# Altium project Solenoid-Switching-Board-v1.0.PrjPcb (part 1 of 5)
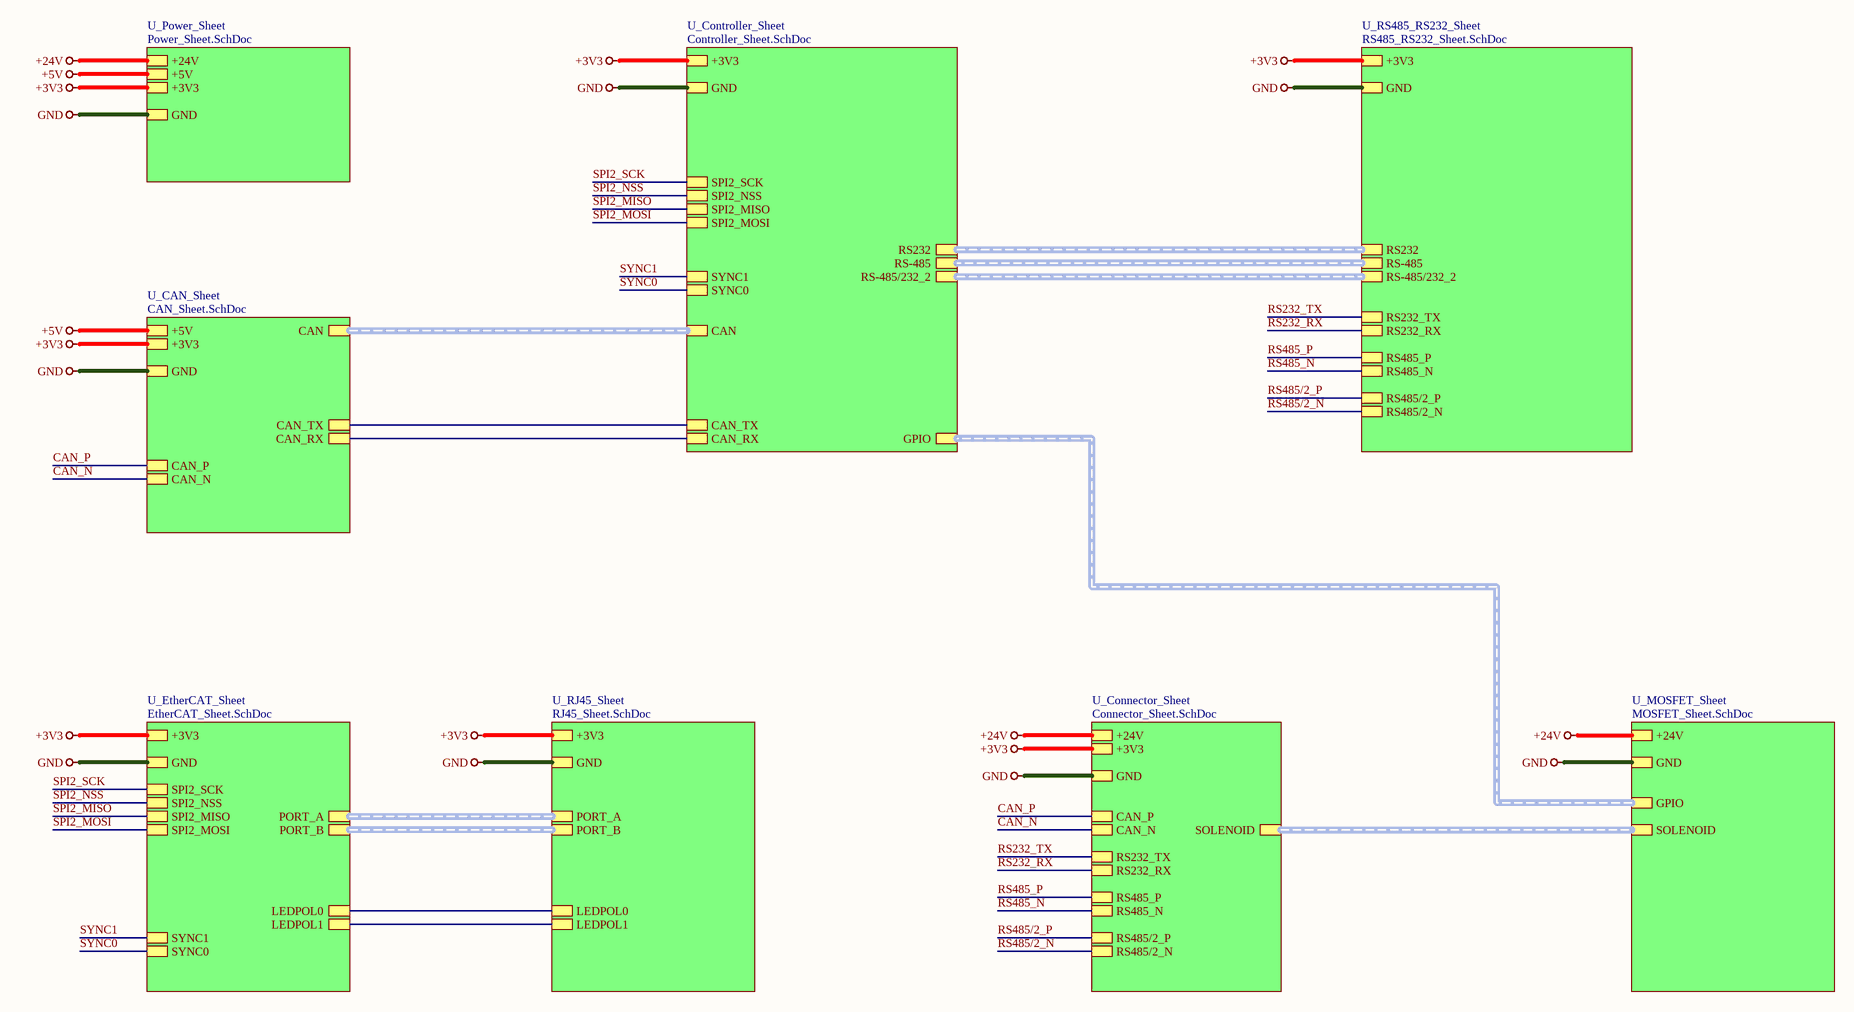
[diagram p0: Top_Sheet.SchDoc]
9 sheets, 288 parts. Net scope: hierarchical (ports join the sheet entries above them; power ports are global).
Board file: PCB_Solenoid_Board-v1.0.PcbDoc
Sheets:
  Top_Sheet.SchDoc
    U_CAN_Sheet = CAN_Sheet.SchDoc
    U_Connector_Sheet = Connector_Sheet.SchDoc
    U_Controller_Sheet = Controller_Sheet.SchDoc
    U_EtherCAT_Sheet = EtherCAT_Sheet.SchDoc
    U_MOSFET_Sheet = MOSFET_Sheet.SchDoc
    U_Power_Sheet = Power_Sheet.SchDoc
    U_RJ45_Sheet = RJ45_Sheet.SchDoc
    U_RS485_RS232_Sheet = RS485_RS232_Sheet.SchDoc

## Sheet Top_Sheet.SchDoc
size 420 x 297 mm; SheetNumber: 1; SheetTotal: 9

### Sub-sheets
U_CAN_Sheet = CAN_Sheet.SchDoc: CAN (harness CAN), CAN_RX, CAN_TX, CAN_P, CAN_N, +5V, +3V3, GND
U_Connector_Sheet = Connector_Sheet.SchDoc: RS485/2_N, RS485/2_P, RS485_N, RS485_P, RS232_RX, RS232_TX, CAN_P, CAN_N, +3V3, GND, +24V, SOLENOID (harness SOLENOID)
U_Controller_Sheet = Controller_Sheet.SchDoc: SPI2_SCK, SPI2_NSS, SPI2_MISO, SPI2_MOSI, RS-485/232_2 (harness RS-485/232_2), RS232 (harness RS232), +3V3, GND, RS-485 (harness RS-485), CAN_RX, CAN_TX, CAN (harness CAN), GPIO (harness GPIO), SYNC1, SYNC0
U_EtherCAT_Sheet = EtherCAT_Sheet.SchDoc: PORT_A (harness PORT_A), PORT_B (harness PORT_B), LEDPOL0, LEDPOL1, SPI2_SCK, SPI2_NSS, SPI2_MISO, SPI2_MOSI, +3V3, GND, SYNC1, SYNC0
U_MOSFET_Sheet = MOSFET_Sheet.SchDoc: SOLENOID (harness SOLENOID), GND, GPIO (harness GPIO), +24V
U_Power_Sheet = Power_Sheet.SchDoc: +24V, +5V, +3V3, GND
U_RJ45_Sheet = RJ45_Sheet.SchDoc: PORT_A (harness PORT_A), PORT_B (harness PORT_B), LEDPOL0, LEDPOL1, +3V3, GND
U_RS485_RS232_Sheet = RS485_RS232_Sheet.SchDoc: RS485_N, RS485_P, RS232_RX, RS232_TX, RS-485 (harness RS-485), +3V3, GND, RS485/2_N, RS485/2_P, RS-485/232_2 (harness RS-485/232_2), RS232 (harness RS232)

### Nets
+3V3: sheet U_CAN_Sheet/+3V3, sheet U_Connector_Sheet/+3V3, sheet U_Controller_Sheet/+3V3, sheet U_EtherCAT_Sheet/+3V3, sheet U_Power_Sheet/+3V3, sheet U_RJ45_Sheet/+3V3, sheet U_RS485_RS232_Sheet/+3V3
+5V: sheet U_CAN_Sheet/+5V, sheet U_Power_Sheet/+5V
+24V: sheet U_Connector_Sheet/+24V, sheet U_MOSFET_Sheet/+24V, sheet U_Power_Sheet/+24V
CAN_RX: sheet U_CAN_Sheet/CAN_RX, sheet U_Controller_Sheet/CAN_RX
CAN_TX: sheet U_CAN_Sheet/CAN_TX, sheet U_Controller_Sheet/CAN_TX
GND: sheet U_CAN_Sheet/GND, sheet U_Connector_Sheet/GND, sheet U_Controller_Sheet/GND, sheet U_EtherCAT_Sheet/GND, sheet U_MOSFET_Sheet/GND, sheet U_Power_Sheet/GND, sheet U_RJ45_Sheet/GND, sheet U_RS485_RS232_Sheet/GND
RS232_RX: sheet U_Connector_Sheet/RS232_RX, sheet U_RS485_RS232_Sheet/RS232_RX
RS232_TX: sheet U_Connector_Sheet/RS232_TX, sheet U_RS485_RS232_Sheet/RS232_TX
CAN_N: sheet U_CAN_Sheet/CAN_N, sheet U_Connector_Sheet/CAN_N
CAN_P: sheet U_CAN_Sheet/CAN_P, sheet U_Connector_Sheet/CAN_P
LEDPOL0: sheet U_EtherCAT_Sheet/LEDPOL0, sheet U_RJ45_Sheet/LEDPOL0
LEDPOL1: sheet U_EtherCAT_Sheet/LEDPOL1, sheet U_RJ45_Sheet/LEDPOL1
RS485/2_N: sheet U_Connector_Sheet/RS485/2_N, sheet U_RS485_RS232_Sheet/RS485/2_N
RS485/2_P: sheet U_Connector_Sheet/RS485/2_P, sheet U_RS485_RS232_Sheet/RS485/2_P
RS485_N: sheet U_Connector_Sheet/RS485_N, sheet U_RS485_RS232_Sheet/RS485_N
RS485_P: sheet U_Connector_Sheet/RS485_P, sheet U_RS485_RS232_Sheet/RS485_P
SPI2_MISO: sheet U_Controller_Sheet/SPI2_MISO, sheet U_EtherCAT_Sheet/SPI2_MISO
SPI2_MOSI: sheet U_Controller_Sheet/SPI2_MOSI, sheet U_EtherCAT_Sheet/SPI2_MOSI
SPI2_NSS: sheet U_Controller_Sheet/SPI2_NSS, sheet U_EtherCAT_Sheet/SPI2_NSS
SPI2_SCK: sheet U_Controller_Sheet/SPI2_SCK, sheet U_EtherCAT_Sheet/SPI2_SCK
SYNC0: sheet U_Controller_Sheet/SYNC0, sheet U_EtherCAT_Sheet/SYNC0
SYNC1: sheet U_Controller_Sheet/SYNC1, sheet U_EtherCAT_Sheet/SYNC1

### Buses and harness runs
harness sheet U_CAN_Sheet/CAN = sheet U_Controller_Sheet/CAN
harness sheet U_Connector_Sheet/SOLENOID = sheet U_MOSFET_Sheet/SOLENOID
harness sheet U_Controller_Sheet/GPIO = sheet U_MOSFET_Sheet/GPIO
harness sheet U_Controller_Sheet/RS232 = sheet U_RS485_RS232_Sheet/RS232
harness sheet U_Controller_Sheet/RS-485 = sheet U_RS485_RS232_Sheet/RS-485
harness sheet U_Controller_Sheet/RS-485/232_2 = sheet U_RS485_RS232_Sheet/RS-485/232_2
harness sheet U_EtherCAT_Sheet/PORT_A = sheet U_RJ45_Sheet/PORT_A
harness sheet U_EtherCAT_Sheet/PORT_B = sheet U_RJ45_Sheet/PORT_B

### Notes on the sheet
- File:
- Title:
- Date:
- Page
- Num:
- Total:
- Drawn By: Huzaifa Ali

## Sheet CAN_Sheet.SchDoc
size 420 x 297 mm; SheetNumber: 4; SheetTotal: 9
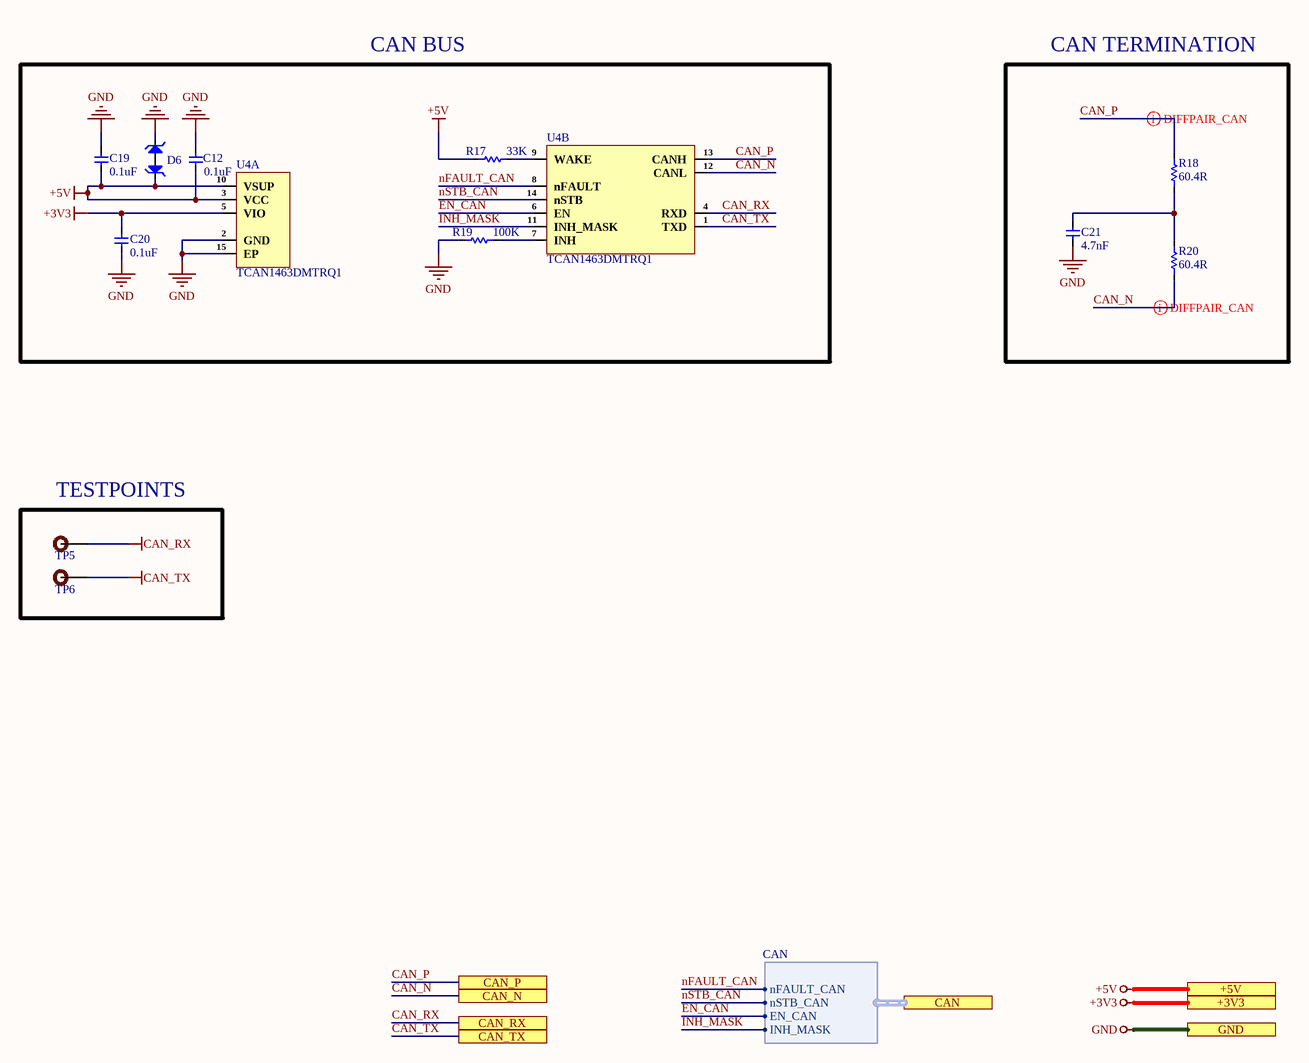
[diagram p1: CAN_Sheet.SchDoc]

### Parts
C12  0.1uF  [Cap-0402]
C19  0.1uF  [Cap-0402]
C20  0.1uF  [Cap-0402]
C21  4.7nF  [Cap-0402]
D6  PESD5V0H1BSFYL  [DSN0603-2]  (value not drawn)
R17  33K  [Res-0402]
R18  60.4R  [Res-0603]
R19  100K  [Res-0402]
R20  60.4R  [Res-0603]
TP5  TEST POINT  [Test-point]  (value not drawn)  (no BOM)
TP6  TEST POINT  [Test-point]  (value not drawn)  (no BOM)
U4  TCAN1463DMTRQ1  [VSON-14(3x4.5)]  (parts A,B of 2)

### Ports
+3V3 (see Top_Sheet[1B], Connector_Sheet[5D], Controller_Sheet[5D], EtherCAT_Sheet[5D], Power_Sheet[5D], RJ45_Sheet[5D], RS485_RS232_Sheet[5D]), +5V (see Top_Sheet[1B], Power_Sheet[5D]), CAN (harness CAN, see Top_Sheet[2B], Controller_Sheet[3D]), CAN_N (see Top_Sheet[1B], Connector_Sheet[3D]), CAN_P (see Top_Sheet[1B], Connector_Sheet[3D]), CAN_RX (see Top_Sheet[2B], Controller_Sheet[2D]), CAN_TX (see Top_Sheet[2B], Controller_Sheet[2D]), GND (see Top_Sheet[1B], Connector_Sheet[5D], Controller_Sheet[5D], EtherCAT_Sheet[5D], MOSFET_Sheet[5D], Power_Sheet[5D], RJ45_Sheet[5D], RS485_RS232_Sheet[5D])

### Harnesses
CAN: nFAULT_CAN, nSTB_CAN, EN_CAN, INH_MASK

### Nets
+3V3: C20.2 U4.5(VIO) ; port +3V3
+5V: C12.1 C19.1 D6.1 R17.1 U4.3(VCC) U4.10(VSUP) ; port +5V
CAN_RX: TP5.1 U4.4(RXD) ; port CAN_RX
CAN_TX: TP6.1 U4.1(TXD) ; port CAN_TX
GND: C12.2 C19.2 C20.1 C21.2 D6.2 R19.1 U4.2(GND) U4.15(EP) ; port GND
CAN_N: R20.2 U4.12(CANL) ; port CAN_N
CAN_P: R18.1 U4.13(CANH) ; port CAN_P
EN_CAN: U4.6(EN) ; port CAN.EN_CAN
INH_MASK: U4.11(INH_MASK) ; port CAN.INH_MASK
nFAULT_CAN: U4.8(nFAULT) ; port CAN.nFAULT_CAN
nSTB_CAN: U4.14(nSTB) ; port CAN.nSTB_CAN
NetC21_1: C21.1 R18.2 R20.1
NetR17_2: R17.2 U4.9(WAKE)
NetR19_2: R19.2 U4.7(INH)

### Layout directives
differential pair; net class CAN; differential pair class CAN_Lines: CAN_N, CAN_P

### Notes on the sheet
- CAN BUS
- CAN TERMINATION
- (near TP5) TESTPOINTS
- File:
- Title:
- Date:
- Page
- Num:
- Total:
- Drawn By: Huzaifa Ali

### Library data of the parts
C12 C19 C20 = CC0402JRX7R7BB104: CAP CER 0.1UF 16V X7R 0402; Manufacturer: Yageo; Material: 4241ConductorMaterial; Value: 100nF; Tolerance: 5%; Item Type: Capacitor; Supplier: Digikey; Supplier Part Number: 311-1676-1-ND; Manufacturer Part Number: CC0402JRX7R7BB104; RoHS: Yes; Category: Ceramic Capacitors; Stock: 1659111; Pricing: 1=0.1, 10=0.046, 50=0.0262, 100=0.0203, 500=0.01528, 1000=0.012, 2500=0.01091, 5000=0.01004 (USD); Mounting Technology: Surface Mount; Case/Package: 0402; Case Code (Metric): 1005; Case Code (Imperial): 0402; Min Operating Temperature: -55°C; Max Operating Temperature: 125°C; Dielectric: X7R; Packaging: Tape and Reel; Package Quantity: 10000; Voltage Rating (DC): 16V; Voltage Rating: 16V; Series: CC; Construction: Flat; Length: 0.039inch; Width: 0.02inch; Height: 0.5mm; Thickness: 0.022inch; Lead Free: Lead Free; Halogen Free: Halogen Free; RoHS Compliant: Yes; ComponentLink1URL: https://datasheet.ciiva.com/13210/upy-gphc-x7r-6-3v-to-50v-8-12304-13210152.pdf?src-supplier=Mouser; ComponentLink1Description: https://datasheet.ciiva.com/13210/upy-gphc-x7r-6-3v-to-50v-8-12304-13210152.pdf?src-supplier=Mouser; LCSC Part Number: C541464
C21 = CC0402KRX7R9BB472: CAP CER 4700PF 50V X7R 0402; Manufacturer: Yageo; Material: 4241ConductorMaterial; Tolerance: 10%; Temperature Coefficient: 30ppm/°C; Item Type: Capacitor; Supplier 1: Future Electronics; Manufacturer Part Number: CC0402KRX7R9BB472; RoHS: Yes; Category: Ceramic Capacitors; Stock 1: 1780000; Pricing 1: 10000=0.0021, 40000=0.002, 150000=0.0019, 400000=0.0018, 1000000=0.0017 (USD); Mount: Surface Mount; Case/Package: 0402; Number of Pins: 2NUMBER; Case Code (Imperial): 0402; Case Code (Metric): 1005; Min Operating Temperature: -55°C; Max Operating Temperature: 125°C; Capacitance: 4.7nF; Dielectric: X7R; Voltage Rating: 50V; Voltage Rating (DC): 50V; Packaging: Tape and Reel; Package Quantity: 1; Termination: SMD/SMT; Series: CC; Construction: Flat; Length: 1mm; Width: 0.02inch; Height: 0.5mm; Thickness: 0.022inch; Depth: 0.5mm; Radiation Hardening: No; Reach SVHC Compliant: No; RoHS Compliant: Yes; Halogen Free: 5694HalogenFree; Lead Free: 5697LeadFree; ComponentLink1URL: https://datasheet.ciiva.com/7978/1489800-7978108.pdf?src-supplier=Element14; ComponentLink1Description: https://datasheet.ciiva.com/7978/1489800-7978108.pdf?src-supplier=Element14; ComponentLink2URL: https://datasheet.ciiva.com/176/mlccorderingcode-176364.pdf?src-supplier=Digikey; ComponentLink2Description: https://datasheet.ciiva.com/176/mlccorderingcode-176364.pdf?src-supplier=Digikey; ComponentLink3URL: https://datasheet.ciiva.com/176/mlccorderingcode-176363.pdf?src-supplier=Digikey; ComponentLink3Description: https://datasheet.ciiva.com/176/mlccorderingcode-176363.pdf?src-supplier=Digikey; ComponentLink4URL: https://datasheet.ciiva.com/176/mlccorderingcode-176365.pdf?src-supplier=Digikey; ComponentLink4Description: https://datasheet.ciiva.com/176/mlccorderingcode-176365.pdf?src-supplier=Digikey; ComponentLink5URL: https://datasheet.ciiva.com/11586/upy-gphc-x7r-6-3v-to-50v-8-11586491.pdf?src-supplier=Avnet; ComponentLink5Description: https://datasheet.ciiva.com/11586/upy-gphc-x7r-6-3v-to-50v-8-11586491.pdf?src-supplier=Avnet; Supplier Part Number 1: 1989300
D6 = PESD5V0H1BSFYL: TVS DIODE 5VWM 6.3VC DSN0603-2; Manufacturer: Nexperia; Supplier 1: Avnet; Manufacturer Part Number: PESD5V0H1BSFYL; RoHS: Yes; Category: ESD and Circuit Protection ICs; Stock 1: 9000; Pricing 1: 18000=0.06453, 36000=0.06278, 54000=0.06104, 90000=0.05930, 180000=0.05755, 900000=0.05581, 1800000=0.05406 (USD); RoHS Compliant: Yes; ComponentLink1URL: http://www.farnell.com/datasheets/1961312.pdf?src-supplier=Farnell; ComponentLink1Description: http://www.farnell.com/datasheets/1961312.pdf?src-supplier=Farnell; ComponentLink2URL: https://assets.nexperia.com/documents/data-sheet/PESD5V0H1BSF.pdf?src-supplier=Digi-Key; ComponentLink2Description: https://assets.nexperia.com/documents/data-sheet/PESD5V0H1BSF.pdf?src-supplier=Digi-Key; ComponentLink3URL: http://www.farnell.com/datasheets/1961312.pdf?src-supplier=Newark; ComponentLink3Description: http://www.farnell.com/datasheets/1961312.pdf?src-supplier=Newark; Supplier Part Number 1: PESD5V0H1BSFYL; LCSC Part Number: C477989; Item Type: Diode
R17 = RC0402FR-0733KL: RES 33K OHM 1% 1/16W 0402; Manufacturer: YAGEO; Item Type: Resistor; Manufacturer Part Number: RC0402FR-0733KL; Package: 0402; LCSC Part Number: C138003; ComponentLink1Description: LCSC; ComponentLink1URL: https://www.lcsc.com/product-detail/Chip-Resistor-Surface-Mount_YAGEO-RC0402FR-0733KL_C138003.html
R18 R20 = RTT0360R4FTP: 100mW Thick Film Resistors ±100ppm/℃ ±1% 60.4Ω 0603 Chip Resistor - Surface Mount ROHS; Manuacturer: RALEC; Manufacturer Part Number: RTT0360R4FTP; Package: 0603; Value: 60.4R; LCSC Part Number: C103744; ComponentLink1Description: LCSC; ComponentLink1URL: https://www.lcsc.com/product-detail/Chip-Resistor-Surface-Mount_RALEC-RTT0360R4FTP_C103744.html
R19 = RC0402FR-07100KL: RES 100K OHM 1% 1/16W 0402; Manufacturer: Yageo; Resistance: 100kR; Temperature Coefficient: 100ppm/°C; Power Rating: 63mW; Voltage Rating: 50V; Item Type: Resistor; Supplier 1: Mouser; Manufacturer Part Number: RC0402FR-07100KL; RoHS: Yes; Category: Chip SMD Resistors; Stock 1: 7759549; Pricing 1: 1=0.10000, 10=0.01200, 50=0.01200, 100=0.00500, 1000=0.00300, 2500=0.00200, 10000=0.00100 (USD); Case/Package: 0402; Case Code (Metric): 1005; Case Code (Imperial): 0402; Min Operating Temperature: -55°C; Max Operating Temperature: 155°C; Resistor Type: Thick Film; Tolerance: 1%; Packaging: Tape and Reel; Package Quantity: 1; Number of Terminations: 2; Termination: SMD/SMT; Max Power Dissipation: 63mW; Working Voltage: 50V; Features: Moisture Resistant; Series: RC; Resistance Tolerance: 1%; Construction: Rectangular; Technology: THICK FILM; Length: 0.039inch; Width: 0.02inch; Height: 0.016inch; Depth: 0.5mm; REACH SVHC: No SVHC; Lead Free: Lead Free; RoHS Compliant: Yes; Military Standard: Not; ComponentLink1URL: https://datasheet.ciiva.com/11819/0900766b80c66297-11819452.pdf?src-supplier=RSComponents; ComponentLink1Description: https://datasheet.ciiva.com/11819/0900766b80c66297-11819452.pdf?src-supplier=RSComponents; ComponentLink2URL: https://datasheet.ciiva.com/22747/1018594-22747509.pdf?src-supplier=Element14; ComponentLink2Description: https://datasheet.ciiva.com/22747/1018594-22747509.pdf?src-supplier=Element14; ComponentLink3URL: https://datasheet.ciiva.com/2453/pyu-r-int-thick-7-2453362.pdf?src-supplier=Digi-Key; ComponentLink3Description: https://datasheet.ciiva.com/2453/pyu-r-int-thick-7-2453362.pdf?src-supplier=Digi-Key; ComponentLink4URL: https://datasheet.ciiva.com/2453/pyu-r-int-thick-7-2453363.pdf?src-supplier=Digi-Key; ComponentLink4Description: https://datasheet.ciiva.com/2453/pyu-r-int-thick-7-2453363.pdf?src-supplier=Digi-Key; ComponentLink5URL: https://datasheet.ciiva.com/2453/pyu-r-int-thick-7-2453361.pdf?src-supplier=Digi-Key; ComponentLink5Description: https://datasheet.ciiva.com/2453/pyu-r-int-thick-7-2453361.pdf?src-supplier=Digi-Key; ComponentLink6URL: https://datasheet.ciiva.com/12667/pyu-rc0402-51-rohs-l-6-r-12667930.pdf?src-supplier=Mouser; ComponentLink6Description: https://datasheet.ciiva.com/12667/pyu-rc0402-51-rohs-l-6-r-12667930.pdf?src-supplier=Mouser; ComponentLink7URL: https://datasheet.ciiva.com/15189/getdatasheetpartid-323696-15189334.pdf?src-supplier=Verical; ComponentLink7Description: https://datasheet.ciiva.com/15189/getdatasheetpartid-323696-15189334.pdf?src-supplier=Verical; Supplier Part Number 1: 603-RC0402FR-07100KL; LCSC Part Number: C60491
TP5 TP6 = TEST POINT: Test Point ON; Item Type: TEST POINT
U4 = TCAN1463DMTRQ1: IC TRANSCEIVER HALF 1/1 14VSON; Manufacturer: Texas Instruments; Supplier: Mouser; Supplier Part Number: 595-TCAN1463DMTRQ1; Manufacturer Part Number: TCAN1463DMTRQ1; RoHS: Yes; Item Type: IC; Stock: 20610; Pricing: 1=2.47, 10=2.22, 50=2.22, 100=1.78, 1000=1.21, 10000=1.09 (USD); LCSC Part Number: C5215823

## Sheet Connector_Sheet.SchDoc
size 420 x 297 mm; SheetNumber: 9; SheetTotal: 9
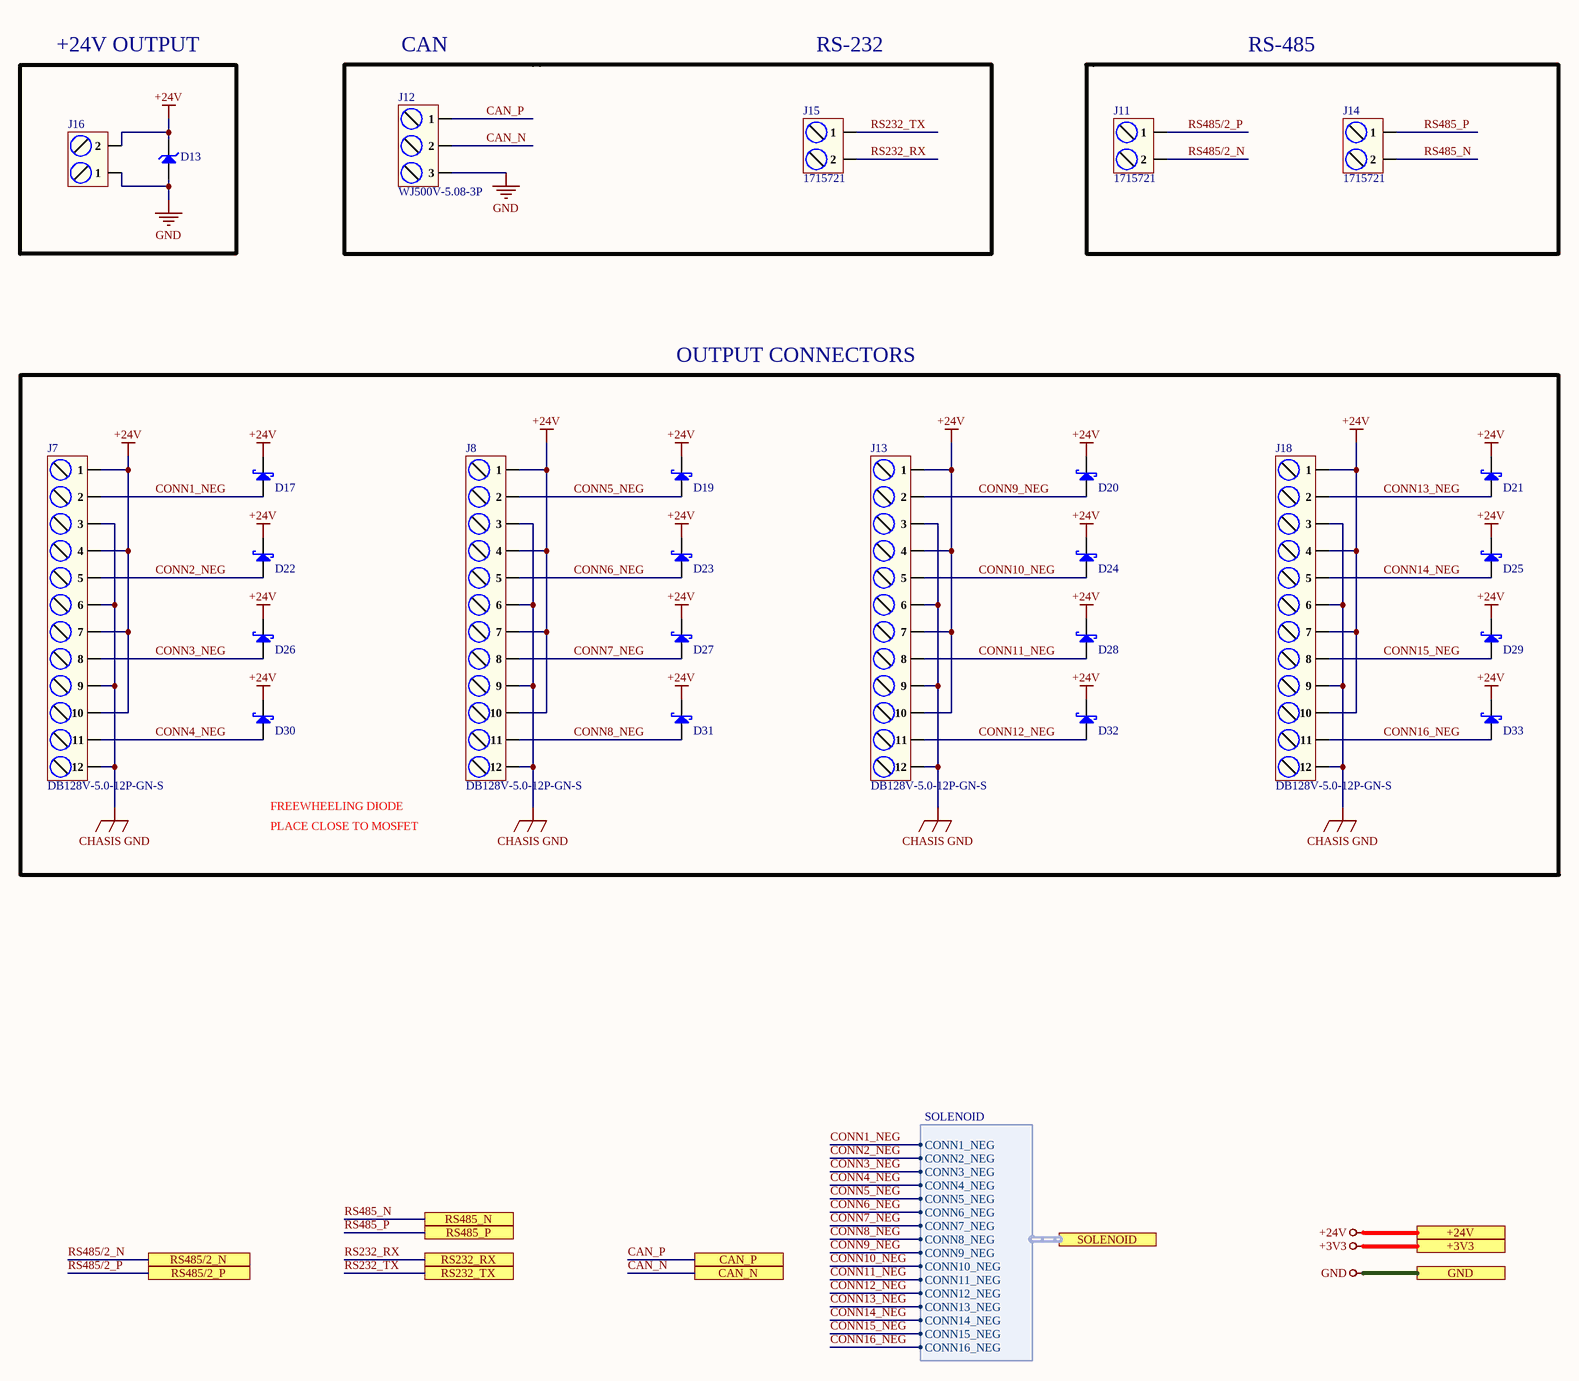
[diagram p2: Connector_Sheet.SchDoc]

### Parts
D13  SMBJ28A-13-F  [SMB_]  (value not drawn)
D17  B150-13-F  [SMA]  (value not drawn)
D19  B150-13-F  [SMA]  (value not drawn)
D20  B150-13-F  [SMA]  (value not drawn)
D21  B150-13-F  [SMA]  (value not drawn)
D22  B150-13-F  [SMA]  (value not drawn)
D23  B150-13-F  [SMA]  (value not drawn)
D24  B150-13-F  [SMA]  (value not drawn)
D25  B150-13-F  [SMA]  (value not drawn)
D26  B150-13-F  [SMA]  (value not drawn)
D27  B150-13-F  [SMA]  (value not drawn)
D28  B150-13-F  [SMA]  (value not drawn)
D29  B150-13-F  [SMA]  (value not drawn)
D30  B150-13-F  [SMA]  (value not drawn)
D31  B150-13-F  [SMA]  (value not drawn)
D32  B150-13-F  [SMA]  (value not drawn)
D33  B150-13-F  [SMA]  (value not drawn)
J7  DB128V-5.0-12P-GN-S  [DB128V-5.0-12P-GN-S]
J8  DB128V-5.0-12P-GN-S  [DB128V-5.0-12P-GN-S]
J11  1715721  [1715721]
J12  WJ500V-5.08-3P  [WJ500V-5.08-3P]
J13  DB128V-5.0-12P-GN-S  [DB128V-5.0-12P-GN-S]
J14  1715721  [1715721]
J15  1715721  [1715721]
J16  MXHB9500-9.5-02P-BK01-Cu-S-A  [MXHB9500-9.5-02P-BK01-Cu-S-A]  (value not drawn)
J18  DB128V-5.0-12P-GN-S  [DB128V-5.0-12P-GN-S]

### Ports
+3V3 (see Top_Sheet[4C], CAN_Sheet[5D], Controller_Sheet[5D], EtherCAT_Sheet[5D], Power_Sheet[5D], RJ45_Sheet[5D], RS485_RS232_Sheet[5D]), +24V (see Top_Sheet[4C], MOSFET_Sheet[5D], Power_Sheet[5D]), CAN_N (see Top_Sheet[4C], CAN_Sheet[3D]), CAN_P (see Top_Sheet[4C], CAN_Sheet[3D]), GND (see Top_Sheet[4C], CAN_Sheet[5D], Controller_Sheet[5D], EtherCAT_Sheet[5D], MOSFET_Sheet[5D], Power_Sheet[5D], RJ45_Sheet[5D], RS485_RS232_Sheet[5D]), RS232_RX (see Top_Sheet[4C], RS485_RS232_Sheet[2D]), RS232_TX (see Top_Sheet[4C], RS485_RS232_Sheet[2D]), RS485/2_N (see Top_Sheet[4C], RS485_RS232_Sheet[1D]), RS485/2_P (see Top_Sheet[4C], RS485_RS232_Sheet[1D]), RS485_N (see Top_Sheet[4C], RS485_RS232_Sheet[2D]), RS485_P (see Top_Sheet[4C], RS485_RS232_Sheet[2D]), SOLENOID (harness SOLENOID, see Top_Sheet[4C], MOSFET_Sheet[2D])

### Harnesses
SOLENOID: CONN1_NEG, CONN2_NEG, CONN3_NEG, CONN4_NEG, CONN5_NEG, CONN6_NEG, CONN7_NEG, CONN8_NEG, CONN9_NEG, CONN10_NEG, CONN11_NEG, CONN12_NEG, CONN13_NEG, CONN14_NEG, CONN15_NEG, CONN16_NEG

### Nets
+24V: D13.2(K) D17.1(K) D19.1(K) D20.1(K) D21.1(K) D22.1(K) D23.1(K) D24.1(K) D25.1(K) D26.1(K) D27.1(K) D28.1(K) D29.1(K) D30.1(K) D31.1(K) D32.1(K) D33.1(K) J7.1 J7.4 J7.7 J7.10 J8.1 J8.4 J8.7 J8.10 J13.1 J13.4 J13.7 J13.10 J16.2 J18.1 J18.4 J18.7 J18.10 ; port +24V
CHASIS GND: J7.3 J7.6 J7.9 J7.12 J8.3 J8.6 J8.9 J8.12 J13.3 J13.6 J13.9 J13.12 J18.3 J18.6 J18.9 J18.12
GND: D13.1(A) J12.3 J16.1 ; port GND
RS232_RX: J15.2 ; port RS232_RX
RS232_TX: J15.1 ; port RS232_TX
CAN_N: J12.2 ; port CAN_N
CAN_P: J12.1 ; port CAN_P
CONN1_NEG: D17.2(A) J7.2 ; port SOLENOID.CONN1_NEG
CONN2_NEG: D22.2(A) J7.5 ; port SOLENOID.CONN2_NEG
CONN3_NEG: D26.2(A) J7.8 ; port SOLENOID.CONN3_NEG
CONN4_NEG: D30.2(A) J7.11 ; port SOLENOID.CONN4_NEG
CONN5_NEG: D19.2(A) J8.2 ; port SOLENOID.CONN5_NEG
CONN6_NEG: D23.2(A) J8.5 ; port SOLENOID.CONN6_NEG
CONN7_NEG: D27.2(A) J8.8 ; port SOLENOID.CONN7_NEG
CONN8_NEG: D31.2(A) J8.11 ; port SOLENOID.CONN8_NEG
CONN9_NEG: D20.2(A) J13.2 ; port SOLENOID.CONN9_NEG
CONN10_NEG: D24.2(A) J13.5 ; port SOLENOID.CONN10_NEG
CONN11_NEG: D28.2(A) J13.8 ; port SOLENOID.CONN11_NEG
CONN12_NEG: D32.2(A) J13.11 ; port SOLENOID.CONN12_NEG
CONN13_NEG: D21.2(A) J18.2 ; port SOLENOID.CONN13_NEG
CONN14_NEG: D25.2(A) J18.5 ; port SOLENOID.CONN14_NEG
CONN15_NEG: D29.2(A) J18.8 ; port SOLENOID.CONN15_NEG
CONN16_NEG: D33.2(A) J18.11 ; port SOLENOID.CONN16_NEG
RS485/2_N: J11.2 ; port RS485/2_N
RS485/2_P: J11.1 ; port RS485/2_P
RS485_N: J14.2 ; port RS485_N
RS485_P: J14.1 ; port RS485_P

### Notes on the sheet
- +24V OUTPUT
- CAN
- RS-232
- RS-485
- OUTPUT CONNECTORS
- FREEWHEELING DIODE
- PLACE CLOSE TO MOSFET
- File:
- Title:
- Date:
- Page
- Num:
- Total:
- Drawn By: Huzaifa Ali

### Library data of the parts
D13 = SMBJ28A-13-F: TVS DIODE 28VWM 45.4VC SMB; Manufacturer: Diodes; Test Current: 1mA; Number of Elements: 1; Power Dissipation: 600W; Forward Voltage: 5V; Direction: Unidirectional; Reverse Breakdown Voltage: 31.1V; Max Surge Current: 13.2A; Reverse Standoff Voltage: 28V; Clamping Voltage: 45.4V; Power Line Protection: No; Breakdown Voltage: 35.8V; Max Reverse Leakage Current: 5uA; Value: 330pF; Diode Type: ZENER; Supplier: Future Electronics; Supplier Part Number: 8797342; Manufacturer Part Number: SMBJ28A-13-F; RoHS: Yes; Category: TVS Diodes; Stock: 39000; Pricing: 3000=0.0734, 9000=0.0706, 15000=0.0693, 30000=0.0676, 60000=0.065 (USD); Mounting Technology: Surface Mount; Case/Package: SMB; Pins: 2; Min Operating Temperature: -55°C; Max Operating Temperature: 150°C; Packaging: Tape and Reel; Package Quantity: 3000; Max Power Dissipation: 600W; Series: SMBJ; Number of Unidirectional Channels: 1; Min Breakdown Voltage: 31.1V; Peak Pulse Power: 600W; Polarity: Unidirectional; Termination: SMD/SMT; Peak Pulse Current: 13.2A; Max Breakdown Voltage: 35.8V; Leakage Current: 5uA; Working Voltage: 28V; Voltage Rating (DC): 28V; Max Output current: 13.2A; Clamping Voltage-Max: 45.4V; Length: 4.57mm; Width: 3.9mm; Height: 2.62mm; Radiation Hardening: No; RoHS Compliant: Yes; Lead Free: Lead Free; ComponentLink1URL: https://datasheet.ciiva.com/16387/ds19002-16387564.pdf?src-supplier=Future+Electronics; ComponentLink1Description: https://datasheet.ciiva.com/16387/ds19002-16387564.pdf?src-supplier=Future+Electronics; ComponentLink2URL: https://datasheet.ciiva.com/26912/getdatasheetpartid-234000-26912533.pdf?src-supplier=Verical; ComponentLink2Description: https://datasheet.ciiva.com/26912/getdatasheetpartid-234000-26912533.pdf?src-supplier=Verical; Item Type: Diode
D17 D19-D33 = B150-13-F: DIODE SCHOTTKY 50V 1A SMA; Manufacturer: Diodes Incorporated; Manufacturer Part Number: B150-13-F; Package: SMA(DO-214AC); LCSC Part Number: C134431; Item Type: Diode
J7 J8 J13 J18 = DB128V-5.0-12P-GN-S: 1x12P 20A -40℃~+105℃ 300V Green 12~30 Direct Insert 5mm 2.5 1 12 Plugin,P=5mm Screw Terminal Blocks ROHS; Manufacturer: DORABO; Manufacturer Part Number: DB128V-5.0-12P-GN-S; Package: Plugin,P=5mm; LCSC Part Number: C424688; Item Type: Terminal Block; ComponentLink1Description: LCSC; ComponentLink1URL: https://www.lcsc.com/product-detail/Screw-Terminal-Blocks_DORABO-DB128V-5-0-12P-GN-S_C424688.html
J11 J14 J15 = 1715721: TERM BLK 2P SIDE ENT 5.08MM PCB; Manufacturer: Phoenix Contact; Item Type: Terminal Blocks; Supplier: Digikey; Supplier Part Number: 277-1263-ND; Manufacturer Part Number: 1715721; RoHS: Yes; Stock: 13160; Pricing: 1=0.94 (USD); ComponentLink1URL: https://datasheet.ciiva.com/1120/1697161-1120393.pdf?src-supplier=Farnell; ComponentLink1Description: https://datasheet.ciiva.com/1120/1697161-1120393.pdf?src-supplier=Farnell; ComponentLink2URL: https://datasheet.ciiva.com/832/1715721-832095.pdf?src-supplier=Digikey; ComponentLink2Description: https://datasheet.ciiva.com/832/1715721-832095.pdf?src-supplier=Digikey; ComponentLink3URL: https://datasheet.ciiva.com/15169/getdatasheetpartid-212174-15169929.pdf?src-supplier=Verical; ComponentLink3Description: https://datasheet.ciiva.com/15169/getdatasheetpartid-212174-15169929.pdf?src-supplier=Verical; ComponentLink4URL: https://datasheet.ciiva.com/16046/1715721-16046034.pdf?src-supplier=Onlinecomponents.com; ComponentLink4Description: https://datasheet.ciiva.com/16046/1715721-16046034.pdf?src-supplier=Onlinecomponents.com
J12 = WJ500V-5.08-3P: 1x3P 18A -40℃~+105℃ 250V Green 14~30 Straight pin 5.08mm 2.5 1 3 Plugin,P=5.08mm Screw terminal ROHS; Manufacturer: Ningbo Kangnex Elec; Item Type: Terminal Block; Manufacturer Part Number: WJ500V-5.08-3P; Package: Plugin,P=5.08mm; LCSC Part Number: C72334; ComponentLink1Description: LCSC; ComponentLink1URL: https://www.lcsc.com/product-detail/Screw-terminal_Ningbo-Kangnex-Elec-WJ500V-5-08-3P_C72334.html
J16 = MXHB9500-9.5-02P-BK01-Cu-S-A: Tin 1x2P Corner pin Three sides 2 1 9.5mm -40℃~+105℃ 20A 300V Black 10~22 Copper Alloy 0.5~4 Plugin,P=9.5mm Barrier Terminal Blocks ROHS; Manufacturer: MAX; Manufacturer Part Number: MXHB9500-9.5-02P-BK01-Cu-S-A; Package: Plugin,P=9.5mm; LCSC Part Number: C7542168; Item Type: Terminal Block; ComponentLink1Description: LCSC; ComponentLink1URL: https://www.lcsc.com/product-detail/Barrier-Terminal-Blocks_MAX-MXHB9500-9-5-02P-BK01-Cu-S-A_C7542168.html